# Altium schematic sheet Powersupply.SchDoc: Black Magic Ursa Power Distribution
size A4; DocumentNumber: 1; Revision: 0; SheetNumber: 1; SheetTotal: 3
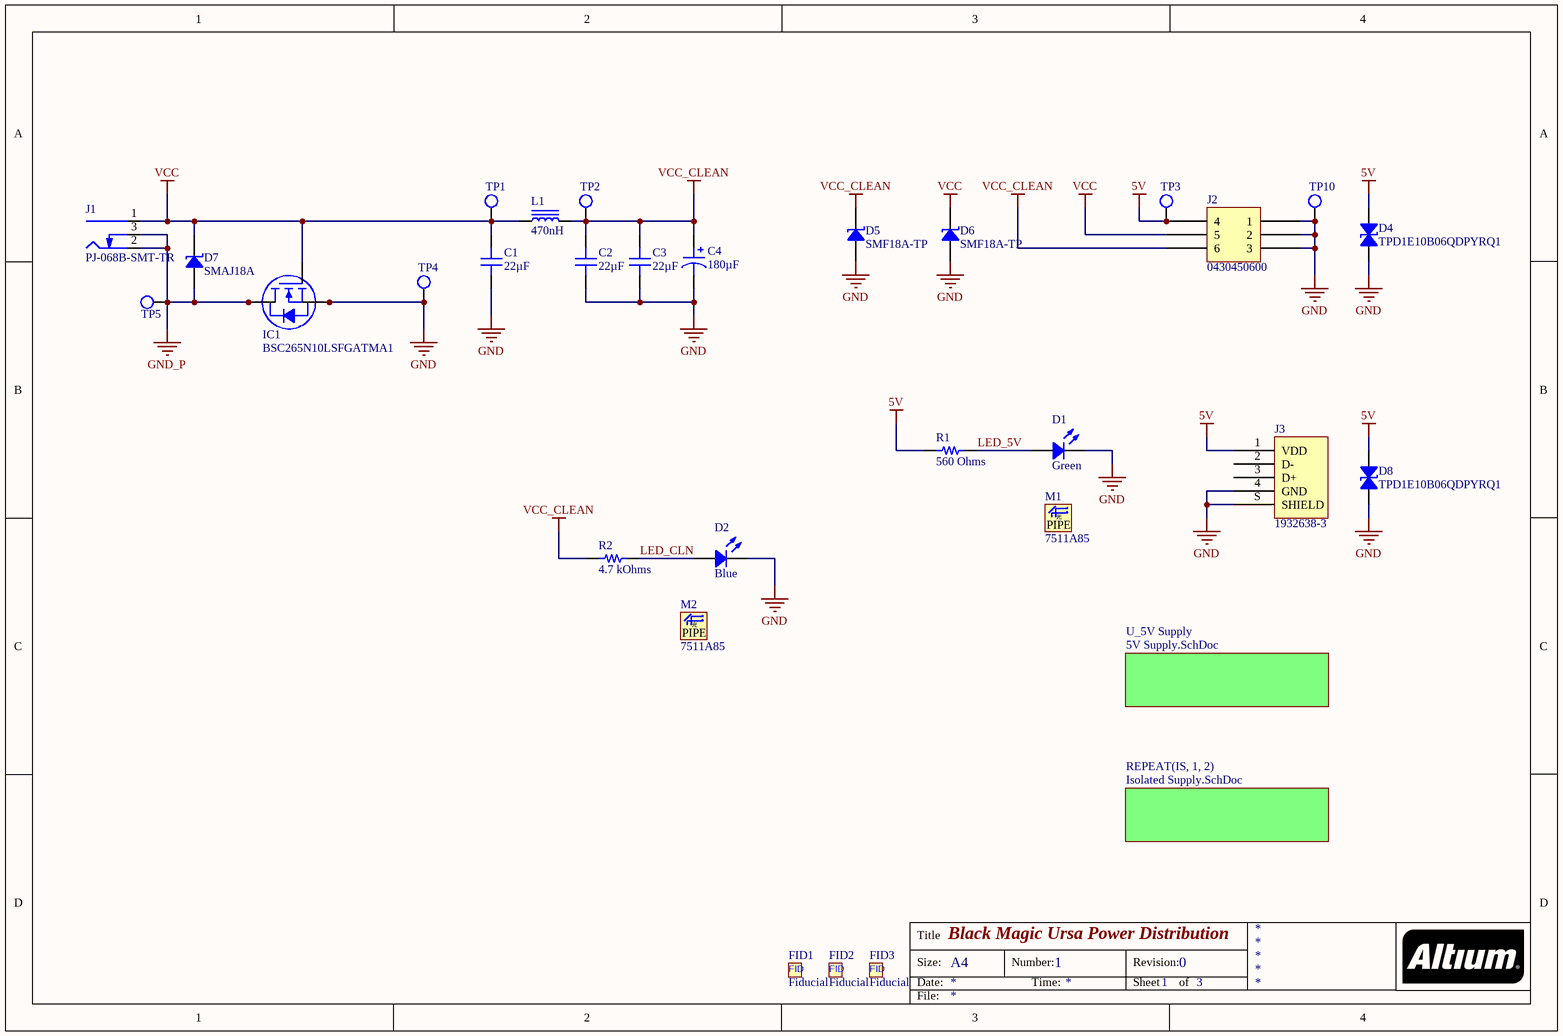
[diagram p0: Powersupply.SchDoc]

## Parts
C1  22µF  [CAP 1210_3225 - 2.8MM]
C2  22µF  [CAP 1210_3225 - 2.8MM]
C3  22µF  [CAP 2220_5650 3.0MM]
C4  180µF  [CAP ALSMD POLY 8.3MM H7.0MM]
D1  Green  [LED 0805_2012 GREEN]
D2  Blue  [LED 0805_2012 BLUE]
D4  TPD1E10B06QDPYRQ1  [0402]
D5  SMF18A-TP  [SOD123F]
D6  SMF18A-TP  [SOD123F]
D7  SMAJ18A  [DO214AC SMA]
D8  TPD1E10B06QDPYRQ1  [0402]
FID1  Fiducial  [Fiducial-1mm]
FID2  Fiducial  [Fiducial-1mm]
FID3  Fiducial  [Fiducial-1mm]
IC1  BSC265N10LSFGATMA1  [INFINEON PG-TDSON-8 6.15X5.32MM]
J1  PJ-068B-SMT-TR  [CUI PJ-068B-SMT]
J2  0430450600  [MOLEX MICRO-FIT 3.0 0430450600]
J3  1932638-3  [TE 1932638-3 USB2.0A]
L1  470nH  [WURTH WE-HCM H9.0MM]
M1  7511A85  [VCC 7511A85]
M2  7511A85  [VCC 7511A85]
R1  560 Ohms  [RES 0603_1608]
R2  4.7 kOhms  [RES 0603_1608]
TP1  Test Point  [TestPoint-1.5mm]  (value not drawn)  (no BOM)
TP2  Test Point  [TestPoint-1.5mm]  (value not drawn)  (no BOM)
TP3  Test Point  [TestPoint-1.5mm]  (value not drawn)  (no BOM)
TP4  Test Point  [TestPoint-1.5mm]  (value not drawn)  (no BOM)
TP5  Test Point  [TestPoint-1.5mm]  (value not drawn)  (no BOM)
TP10  Test Point  [TestPoint-1.5mm]  (value not drawn)  (no BOM)

## Sub-sheets
REPEAT(IS, 1, 2) = Isolated Supply.SchDoc: no entries
U_5V Supply = 5V Supply.SchDoc: no entries

## Nets
5V: D4.2 D8.2 J2.4 J3.1(VDD) R1.1 TP3.1(TP)
GND: C1.1 C2.1 C3.1 C4.2 D1.2 D2.2 D4.1 D5.1 D6.1 D8.1 IC1.1(S) IC1.2(S) IC1.3(S) J2.1 J2.2 J2.3 J3.4(GND) J3.S(SHIELD) TP4.1(TP) TP10.1(TP)
GND_P: D7.1 IC1.5(D) IC1.6(D) IC1.7(D) IC1.8(D) J1.2(Outer) J1.3(SW) TP5.1(TP)
VCC: C1.2 D6.2 D7.2 IC1.4(G) J1.1(Centre) J2.5 L1.1 TP1.1(TP)
VCC_CLEAN: C2.2 C3.2 C4.1 D5.2 J2.6 L1.2 R2.1 TP2.1(TP)
LED_5V: D1.1 R1.2
LED_CLN: D2.1 R2.2

Not connected (* = marked no-connect by the designer): J3 2(D-) 3(D+)

## Notes on the sheet
- Title
- Size:
- Date:
- A4
- Number:
- Time:
- Revision:
- Sheet
- of
- File:
- (in symbol 7511A85) 光; PIPE
- (in symbol Fiducial) FID

## Library data of the parts
C1 C2 = CL32A226KAJNNNE: CAP CER 22UF 25V X5R 1210; Manufacturer: Samsung Electro-Mechanics; Tolerance: ±10%; Part Number: CL32A226KAJNNNE; Value: 22µF; Applications: General Purpose; Capacitance: 22µF; ComponentLink1Description: Datasheet; ComponentLink1URL: http://www.samsungsem.com/kr/support/product-search/mlcc/CL32A226KAJNNNE.jsp; ComponentLink2Description: DigiKey Link; ComponentLink2URL: http://digikey.com/product-detail/en/samsung-electro-mechanics/CL32A226KAJNNNE/1276-1101-1-ND/3889187; Device Package: 1210 (3225 Metric); LastUpdated: 21/01/2020 00:30:21; Lifecycle Status: Active; Minimum Order: 1; Mounting Type: Surface Mount, MLCC; Operating Temperature: -55°C ~ 85°C; Package / Case: 1210 (3225 Metric); Packaging: TapeAndReel; PartId: 24102; Part Status: Active; Price: 0.13; Series: CL; Size / Dimension: 0.126" L x 0.098" W (3.20mm x 2.50mm); Supplier 1: DigiKey; Supplier Part Number 1: 1276-1101-1-ND; Temperature Coefficient: X5R; Thickness (Max): 0.106" (2.70mm); Voltage - Rated: 25V
C3 = C5750X7R1E226M250KA: CAP CER 22UF 25V X7R 2220; Manufacturer: TDK Corporation; Tolerance: ±20%; Applications: General Purpose; Capacitance: 22µF; ComponentLink1Description: Datasheet; ComponentLink1URL: https://product.tdk.com/info/en/catalog/datasheets/mlcc_commercial_general_en.pdf?ref_disty=digikey; ComponentLink2Description: DigiKey Link; ComponentLink2URL: http://digikey.com/product-detail/en/tdk-corporation/C5750X7R1E226M250KA/445-1453-1-ND/569119; Device Package: 2220 (5750 Metric); Features: Low ESL; LastUpdated: 21/01/2020 00:35:18; Lifecycle Status: Active; Part Number: C5750X7R1E226M250KA; Minimum Order: 1; Mounting Type: Surface Mount, MLCC; Operating Temperature: -55°C ~ 125°C; Package / Case: 2220 (5750 Metric); Packaging: TapeAndReel; Part Status: Active; Price: 0.90; Series: C; Size / Dimension: 0.224" L x 0.197" W (5.70mm x 5.00mm); Supplier 1: DigiKey; Supplier Part Number 1: 445-1453-1-ND; Temperature Coefficient: X7R; Thickness (Max): 0.110" (2.80mm); Value: 22µF; Voltage - Rated: 25V
C4 = APXG200ARA181MH70G: CAP ALUM POLY 180UF 20% 20V SMD; Manufacturer: United Chemi-Con; ESR (Equivalent Series Resistance): 25mOhm; Lifetime @ Temp.: 15000 Hrs @ 105°C; Ripple Current @ High Frequency: 3.2A @ 100kHz; Surface Mount Land Size: 0.327" L x 0.327" W (8.30mm x 8.30mm); Type: Polymer; Part Number: APXG200ARA181MH70G; Applications: General Purpose; Capacitance: 180µF; ComponentLink1Description: Datasheet; ComponentLink1URL: http://www.chemi-con.co.jp/cgi-bin/CAT_DB/SEARCH/cat_db_al.cgi?e=e&j=p&pdfname=pxg; ComponentLink2Description: DigiKey Link; ComponentLink2URL: http://digikey.com/product-detail/en/united-chemi-con/APXG200ARA181MH70G/565-4296-1-ND/5824817; Device Package: Radial, Can - SMD; Height - Seated (Max): 0.276" (7.00mm); LastUpdated: 21/01/2020 04:07:43; Lifecycle Status: Active; Minimum Order: 1; Mounting Type: Surface Mount; Operating Temperature: -55°C ~ 105°C; Package / Case: Radial, Can - SMD; Packaging: TapeAndReel; PartId: 2499; Part Status: Active; Price: 0.37; Series: NPCAP™-PXG; Size / Dimension: 0.315" Dia (8.00mm); Supplier 1: DigiKey; Supplier Part Number 1: 565-4296-1-ND; Tolerance: ±20%; Value: 180µF; Voltage - Rated: 20V
D1 = LTST-C170GKT: LED GREEN CLEAR SMD; Manufacturer: Lite-On Inc.; Configuration: Standard; Current - Test: 10mA; Lens Color: Colorless; Lens Size: 1.40mm x 1.25mm; Lens Style: Rectangle with Flat Top; Millicandela Rating: 6mcd; Viewing Angle: 130°; Voltage - Forward (Vf) (Typ): 2.1V; Wavelength - Dominant: 569nm; Wavelength - Peak: 565nm; Part Number: LTST-C170GKT; Color: Green; ComponentLink1Description: Datasheet; ComponentLink1URL: //media.digikey.com/pdf/Data%20Sheets/Lite-On%20PDFs/LTST-C170GKT.pdf; ComponentLink2Description: DigiKey Link; ComponentLink2URL: http://digikey.com/product-detail/en/lite-on-inc/LTST-C170GKT/160-1179-1-ND/269251; Device Package: 0805 (2012 Metric); Height (Max): 1.10mm; LastUpdated: 21/01/2020 03:14:10; Lens Transparency: Clear; Lifecycle Status: Active; Minimum Order: 1; Mounting Type: Surface Mount; Package / Case: 0805 (2012 Metric); Packaging: TapeAndReel; PartId: 282; Part Status: Active; Price: 0.05; Series: -; Size / Dimension: 2.00mm L x 1.25mm W; Supplier 1: DigiKey; Supplier Part Number 1: 160-1179-1-ND; Value: Green
D2 = IN-S85AT5B: LED BLUE CLEAR 0805 SMD; Manufacturer: Inolux; Configuration: Standard; Current - Test: 5mA; Lens Size: 1.40mm x 1.25mm; Lens Style: Rectangle with Flat Top; Millicandela Rating: 80mcd; Viewing Angle: 120°; Voltage - Forward (Vf) (Typ): 3V; Wavelength - Dominant: 470nm; Wavelength - Peak: 473nm; Part Number: IN-S85AT5B; Color: Blue; ComponentLink1Description: Datasheet; ComponentLink1URL: http://www.inolux-corp.com/datasheet/SMDLED/Mono%20Color%20Top%20View/IN-S85AT%20Series_V1.1.pdf; ComponentLink2Description: DigiKey Link; ComponentLink2URL: http://digikey.com/product-detail/en/inolux/IN-S85AT5B/1830-1078-1-ND/7604720; Device Package: 0805 (2012 Metric); Height (Max): 1.10mm; LastUpdated: 21/01/2020 03:11:15; Lens Color: Clear; Lens Transparency: Clear; Lifecycle Status: Active; Minimum Order: 1; Mounting Type: Surface Mount; Package / Case: 0805 (2012 Metric); Packaging: TapeAndReel; PartId: 751; Part Status: Active; Price: 0.06; Series: IN-S85AT; Size / Dimension: 2.00mm L x 1.25mm W; Supplier 1: DigiKey; Supplier Part Number 1: 1830-1078-1-ND; Supplier Device Package: 0805; Value: Blue
D4 D8 = TPD1E10B06QDPYRQ1: TVS DIODE 5.5V 14V 2X1SON; Manufacturer: Texas Instruments; Bidirectional Channels: 1; Capacitance @ Frequency: 12pF @ 1MHz; Current - Peak Pulse (10/1000µs): 6A (8/20µs); Power Line Protection: No; Power - Peak Pulse: 90W; Type: Zener; Voltage - Breakdown (Min): 6V; Voltage - Clamping (Max) @ Ipp: 14V (Typ); Voltage - Reverse Standoff (Typ): 5.5V (Max); Part Number: TPD1E10B06QDPYRQ1; Applications: Automotive; ComponentLink1Description: Datasheet; ComponentLink1URL: http://www.ti.com/general/docs/suppproductinfo.tsp?distId=10&gotoUrl=http%3A%2F%2Fwww.ti.com%2Flit%2Fgpn%2Ftpd1e10b06-q1; ComponentLink2Description: DigiKey Link; ComponentLink2URL: http://digikey.com/product-detail/en/texas-instruments/TPD1E10B06QDPYRQ1/296-TPD1E10B06QDPYRQ1CT-ND/6609868; Device Package: 0402 (1006 Metric); LastUpdated: 21/03/2020 02:05:15; Lifecycle Status: Active; Minimum Order: 1; Mounting Type: Surface Mount; Operating Temperature: -40°C ~ 125°C (TA); Package / Case: 0402 (1006 Metric); Packaging: TapeAndReel; PartId: 10475; Part Status: Active; Price: 0.08; Series: Automotive, AEC-Q101; Supplier 1: DigiKey; Supplier Part Number 1: 296-TPD1E10B06QDPYRQ1CT-ND; Supplier Device Package: 2-X1SON (1x.60)
D5 D6 = SMF18A-TP: TVS DIODE 18V 29.2V SOD123FL; Manufacturer: Micro Commercial Co; Current - Peak Pulse (10/1000µs): 6.8A; Power Line Protection: No; Power - Peak Pulse: 200W; Type: Zener; Unidirectional Channels: 1; Voltage - Breakdown (Min): 20V; Part Number: SMF18A-TP; Applications: General Purpose; ComponentLink1Description: Datasheet; ComponentLink1URL: https://www.mccsemi.com/pdf/Products/SMF5.0-170(SOD-123FL)-V2.pdf; ComponentLink2Description: DigiKey Link; ComponentLink2URL: http://digikey.com/product-detail/en/micro-commercial-co/SMF18A-TP/SMF18A-TPMSCT-ND/5114017; Device Package: SOD-123F; LastUpdated: 21/03/2020 01:50:28; Lifecycle Status: Active; Minimum Order: 1; Mounting Type: Surface Mount; Operating Temperature: -65°C ~ 175°C (TA); Package / Case: SOD-123F; Packaging: TapeAndReel; PartId: 10171; Part Status: Active; Price: 0.09; Series: -; Supplier 1: DigiKey; Supplier Part Number 1: SMF18A-TPMSCT-ND; Supplier Device Package: SOD-123FL; Voltage - Clamping (Max) @ Ipp: 29.2V; Voltage - Reverse Standoff (Typ): 18V
D7 = SMAJ18A: TVS DIODE 18V 29.2V SMA; Manufacturer: Bourns Inc.; Current - Peak Pulse (10/1000µs): 13.7A; Power Line Protection: No; Power - Peak Pulse: 400W; Type: Zener; Unidirectional Channels: 1; Voltage - Breakdown (Min): 20V; Part Number: SMAJ18A; Applications: General Purpose; ComponentLink1Description: Datasheet; ComponentLink1URL: https://www.bourns.com/docs/Product-Datasheets/SMAJ.pdf; ComponentLink2Description: DigiKey Link; ComponentLink2URL: http://digikey.com/product-detail/en/bourns-inc/SMAJ18A/SMAJ18ABCT-ND/2254344; Device Package: DO-214AC, SMA; LastUpdated: 21/03/2020 00:56:27; Lifecycle Status: Active; Minimum Order: 1; Mounting Type: Surface Mount; Operating Temperature: -55°C ~ 150°C (TJ); Package / Case: DO-214AC, SMA; Packaging: TapeAndReel; PartId: 5766; Part Status: Active; Price: 0.08; Series: SMAJ; Supplier 1: DigiKey; Supplier Part Number 1: SMAJ18ABCT-ND; Supplier Device Package: SMA (DO-214AC); Voltage - Clamping (Max) @ Ipp: 29.2V; Voltage - Reverse Standoff (Typ): 18V
IC1 = BSC265N10LSFGATMA1: MOSFET N-CH 100V 40A TDSON-8; Manufacturer: Infineon Technologies; Current - Continuous Drain (Id) @ 25°C: 6.5A (Ta), 40A (Tc); Drive Voltage (Max Rds On,  Min Rds On): 4.5V, 10V; FET Type: N-Channel; Gate Charge (Qg) (Max) @ Vgs: 21nC @ 10V; Input Capacitance (Ciss) (Max) @ Vds: 1600pF @ 50V; Power Dissipation (Max): 78W (Tc); Rds On (Max) @ Id, Vgs: 26.5mOhm @ 20A, 10V; Vgs (Max): ±20V; Vgs(th) (Max) @ Id: 2.4V @ 43µA; Part Number: BSC265N10LSFGATMA1; ComponentLink1Description: Datasheet; ComponentLink1URL: https://www.infineon.com/dgdl/BSC265N10LSF+G_+Rev2.06.pdf?folderId=db3a304313b8b5a60113cee8763b02d7&fileId=db3a30431b3e89eb011b49a375207b46; ComponentLink2Description: DigiKey Link; ComponentLink2URL: http://digikey.com/product-detail/en/infineon-technologies/BSC265N10LSFGATMA1/BSC265N10LSFGATMA1CT-ND/5958872; Device Package: 8-PowerTDFN; Drain to Source Voltage (Vdss): 100V; LastUpdated: 04/02/2020 03:37:28; Lifecycle Status: Active; Minimum Order: 1; Mounting Type: Surface Mount; Operating Temperature: -55°C ~ 150°C (TJ); Package / Case: 8-PowerTDFN; Packaging: TapeAndReel; Part Status: Active; Price: 0.43; Series: OptiMOS™; Supplier 1: DigiKey; Supplier Part Number 1: BSC265N10LSFGATMA1CT-ND; Supplier Device Package: PG-TDSON-8-1; Technology: MOSFET (Metal Oxide)
J1 = PJ-068B-SMT-TR: CONN PWR JACK 2.5X5.5MM SOLDER; Manufacturer: CUI Devices; Actual Diameter: 0.098" (2.50mm ID), 0.232" (5.90mm OD); Current Rating (Amps): 5A; Gender: Male; Industry Recognized Mating Diameter: 2.50mm ID (0.098"), 5.50mm OD (0.217"); Internal Switch(s): Single Switch, Normally Closed; Material Flammability Rating: UL94 V-0; Mating Length/Depth: 0.323" (8.20mm); Number of Positions/Contacts: 2 Conductors, 3 Contacts; Shielding: Shielded; Voltage - Rated: 24VDC; Part Number: PJ-068B-SMT-TR; ComponentLink1Description: Datasheet; ComponentLink1URL: https://www.cuidevices.com/product/resource/digikeypdf/pj-068b-smt-tr.pdf; ComponentLink2Description: DigiKey Link; ComponentLink2URL: //digikey.com/product-detail/en/cui-devices/PJ-068B-SMT-TR/CP-068BPJTR-ND/2625163; Connector Type: Jack; Features: Board Guide; LastUpdated: 16/12/2019 18:57:10; Lifecycle Status: 0; Minimum Order: 1; Mounting Type: Surface Mount, Right Angle; Packaging: TapeAndReel; Part Status: Active; Price: 1.38; Series: -; Supplier 1: DigiKey; Supplier Part Number 1: CP-068BPJTR-ND; Termination: Solder
J2 = 0430450600: CONN HEADER R/A 6POS 3MM; Manufacturer: Molex; Contact Length - Post: 0.125" (3.18mm); Current Rating (Amps): 8A; Material Flammability Rating: UL94 V-0; Number of Positions: 6; Number of Positions Loaded: All; Pitch - Mating: 0.118" (3.00mm); Shrouding: Shrouded - 4 Wall; Style: Board to Cable/Wire; Voltage Rating: 600V; Part Number: 0430450600; ComponentLink1Description: Datasheet; ComponentLink1URL: https://www.molex.com/pdm_docs/ps/PS-43045.pdf; ComponentLink2Description: DigiKey Link; ComponentLink2URL: http://digikey.com/product-detail/en/molex/0430450600/WM1815-ND/252528; Connector Type: Header; Contact Finish - Mating: Tin; Contact Finish - Post: Tin; Contact Finish Thickness - Mating: 100.0µin (2.54µm); Contact Material: Brass; Contact Shape: Square; Contact Type: Male Pin; Fastening Type: Locking Ramp; Features: Board Lock; Insulation Color: Black; Insulation Height: 0.290" (7.37mm); Insulation Material: Liquid Crystal Polymer (LCP), Glass Filled; LastUpdated: 20/03/2020 03:58:57; Lifecycle Status: Active; Minimum Order: 1; Mounting Type: Through Hole, Right Angle; Number of Rows: 2; Packaging: Tray; PartId: 133; Part Status: Active; Price: 1.80; Row Spacing - Mating: 0.118" (3.00mm); Series: Micro-Fit 3.0 43045; Supplier 1: DigiKey; Supplier Part Number 1: WM1815-ND; Termination: Solder
J3 = 1932638-3: CONN RCPT USB2.0 TYPEA 4P SMD RA; Manufacturer: TE Connectivity AMP Connectors; Connector Type: USB - A; Current Rating (Amps): 1A per Contact; Gender: Receptacle; Mating Cycles: 1500; Number of Contacts: 4; Number of Ports: 1; Shielding: Shielded; Voltage - Rated: 30VAC; Part Number: 1932638-3; ComponentLink1Description: Datasheet; ComponentLink1URL: https://www.te.com/commerce/DocumentDelivery/DDEController?Action=srchrtrv&DocNm=501-60007-1&DocType=SS&DocLang=EN; ComponentLink2Description: DigiKey Link; ComponentLink2URL: //digikey.com/product-detail/en/te-connectivity-amp-connectors/1932638-3/A117902TR-ND/4731612; Features: Solder Retention; LastUpdated: 09/12/2019 20:47:08; Lifecycle Status: 0; Minimum Order: 1; Mounting Feature: Horizontal; Mounting Type: Surface Mount, Right Angle; Operating Temperature: -55°C ~ 85°C; Packaging: TapeAndReel; Part Status: Active; Price: 0.97; Series: -; Specifications: USB 2.0; Supplier 1: DigiKey; Supplier Part Number 1: A117902TR-ND; Termination: Solder
L1 = 744309047: FIXED IND 470NH 47.5A 0.165 MOHM; Manufacturer: Würth Elektronik; Current - Saturation: 40.5A; Frequency - Self Resonant: 95MHz; Inductance Frequency - Test: 100kHz; Material - Core: Manganese Zinc Ferrite (MnZn); Shielding: Shielded; Tolerance: ±20%; Type: Wirewound; Part Number: 744309047; ComponentLink1Description: Datasheet; ComponentLink1URL: https://katalog.we-online.de/pbs/datasheet/744309047.pdf; ComponentLink2Description: DigiKey Link; ComponentLink2URL: http://digikey.com/product-detail/en/w-rth-elektronik/744309047/732-3007-1-ND/2626131; Current Rating (Amps): 47.5A; DC Resistance (DCR): 0.165mOhm; Device Package: Nonstandard; Height - Seated (Max): 0.374" (9.50mm); Inductance: 470nH; LastUpdated: 20/03/2020 00:29:57; Lifecycle Status: Active; Minimum Order: 1; Mounting Type: Surface Mount; Operating Temperature: -40°C ~ 125°C; Package / Case: Nonstandard; Packaging: TapeAndReel; PartId: 3389; Part Status: Active; Price: 1.81; Series: WE-HCM; Size / Dimension: 0.551" L x 0.512" W (14.00mm x 13.00mm); Supplier 1: DigiKey; Supplier Part Number 1: 732-3007-1-ND; Value: 470nH
M1 M2 = 7511A85: LIGHT PIPE RIGHT ANG SINGLE POS; Manufacturer: Visual Communications Company - VCC; Lens Size: 3mm; Lens Style: Round with Flat Top; Color: Clear; ComponentLink1Description: Datasheet; ComponentLink1URL: https://vcclite.com/wp-content/uploads/wpallimport/files/files/7511A85%207511A62%207511B11%20Series%20BrightPipes%20Optical%20Lightpipes.pdf; ComponentLink2Description: DigiKey Link; ComponentLink2URL: http://digikey.com/product-detail/en/visual-communications-company-vcc/7511A85/L70510-ND/397876; Configuration: Single; LastUpdated: 20/03/2020 05:35:42; Lifecycle Status: Active; Part Number: 7511A85; Minimum Order: 1; Mounting Type: Board Mount, Press Fit, Right Angle; Packaging: Unknown; Part Status: Active; Price: 0.93; Series: Bright Pipes™, 7511; Supplier 1: DigiKey; Supplier Part Number 1: L70510-ND; Type: Rigid
R1 = ERJ-PA3J561V: RES SMD 560 OHM 5% 1/4W 0603; Manufacturer: Panasonic Electronic Components; Power (Watts): 0.25W, 1/4W; Temperature Coefficient: ±200ppm/°C; Part Number: ERJ-PA3J561V; Value: 560 Ohms; ComponentLink1Description: Datasheet; ComponentLink1URL: https://industrial.panasonic.com/cdbs/www-data/pdf/RDO0000/AOA0000C331.pdf; ComponentLink2Description: DigiKey Link; ComponentLink2URL: http://digikey.com/product-detail/en/panasonic-electronic-components/ERJ-PA3J561V/P560BZCT-ND/5036343; Composition: Thick Film; Device Package: 0603 (1608 Metric); Features: Automotive AEC-Q200, Pulse Withstanding; Height - Seated (Max): 0.022" (0.55mm); LastUpdated: 21/01/2020 00:18:33; Lifecycle Status: Active; Minimum Order: 1; Number of Terminations: 2; Operating Temperature: -55°C ~ 155°C; Package / Case: 0603 (1608 Metric); Packaging: TapeAndReel; PartId: 20561; Part Status: Active; Price: 0.01; Ratings: AEC-Q200; Resistance: 560 Ohms; Series: ERJ; Size / Dimension: 0.063" L x 0.031" W (1.60mm x 0.80mm); Supplier 1: DigiKey; Supplier Part Number 1: P560BZCT-ND; Supplier Device Package: 0603; Tolerance: ±5%
R2 = ERJ-PA3J472V: RES SMD 4.7K OHM 5% 1/4W 0603; Manufacturer: Panasonic Electronic Components; Power (Watts): 0.25W, 1/4W; Temperature Coefficient: ±200ppm/°C; Part Number: ERJ-PA3J472V; Value: 4.7 kOhms; ComponentLink1Description: Datasheet; ComponentLink1URL: https://industrial.panasonic.com/cdbs/www-data/pdf/RDO0000/AOA0000C331.pdf; ComponentLink2Description: DigiKey Link; ComponentLink2URL: http://digikey.com/product-detail/en/panasonic-electronic-components/ERJ-PA3J472V/P4.7KBZCT-ND/5036332; Composition: Thick Film; Device Package: 0603 (1608 Metric); Features: Automotive AEC-Q200, Pulse Withstanding; Height - Seated (Max): 0.022" (0.55mm); LastUpdated: 21/01/2020 00:23:05; Lifecycle Status: Active; Minimum Order: 1; Number of Terminations: 2; Operating Temperature: -55°C ~ 155°C; Package / Case: 0603 (1608 Metric); Packaging: TapeAndReel; PartId: 9675; Part Status: Active; Price: 0.01; Ratings: AEC-Q200; Resistance: 4.7 kOhms; Series: ERJ; Size / Dimension: 0.063" L x 0.031" W (1.60mm x 0.80mm); Supplier 1: DigiKey; Supplier Part Number 1: P4.7KBZCT-ND; Supplier Device Package: 0603; Tolerance: ±5%